# Altium project DoAn_NEW.PrjPcb
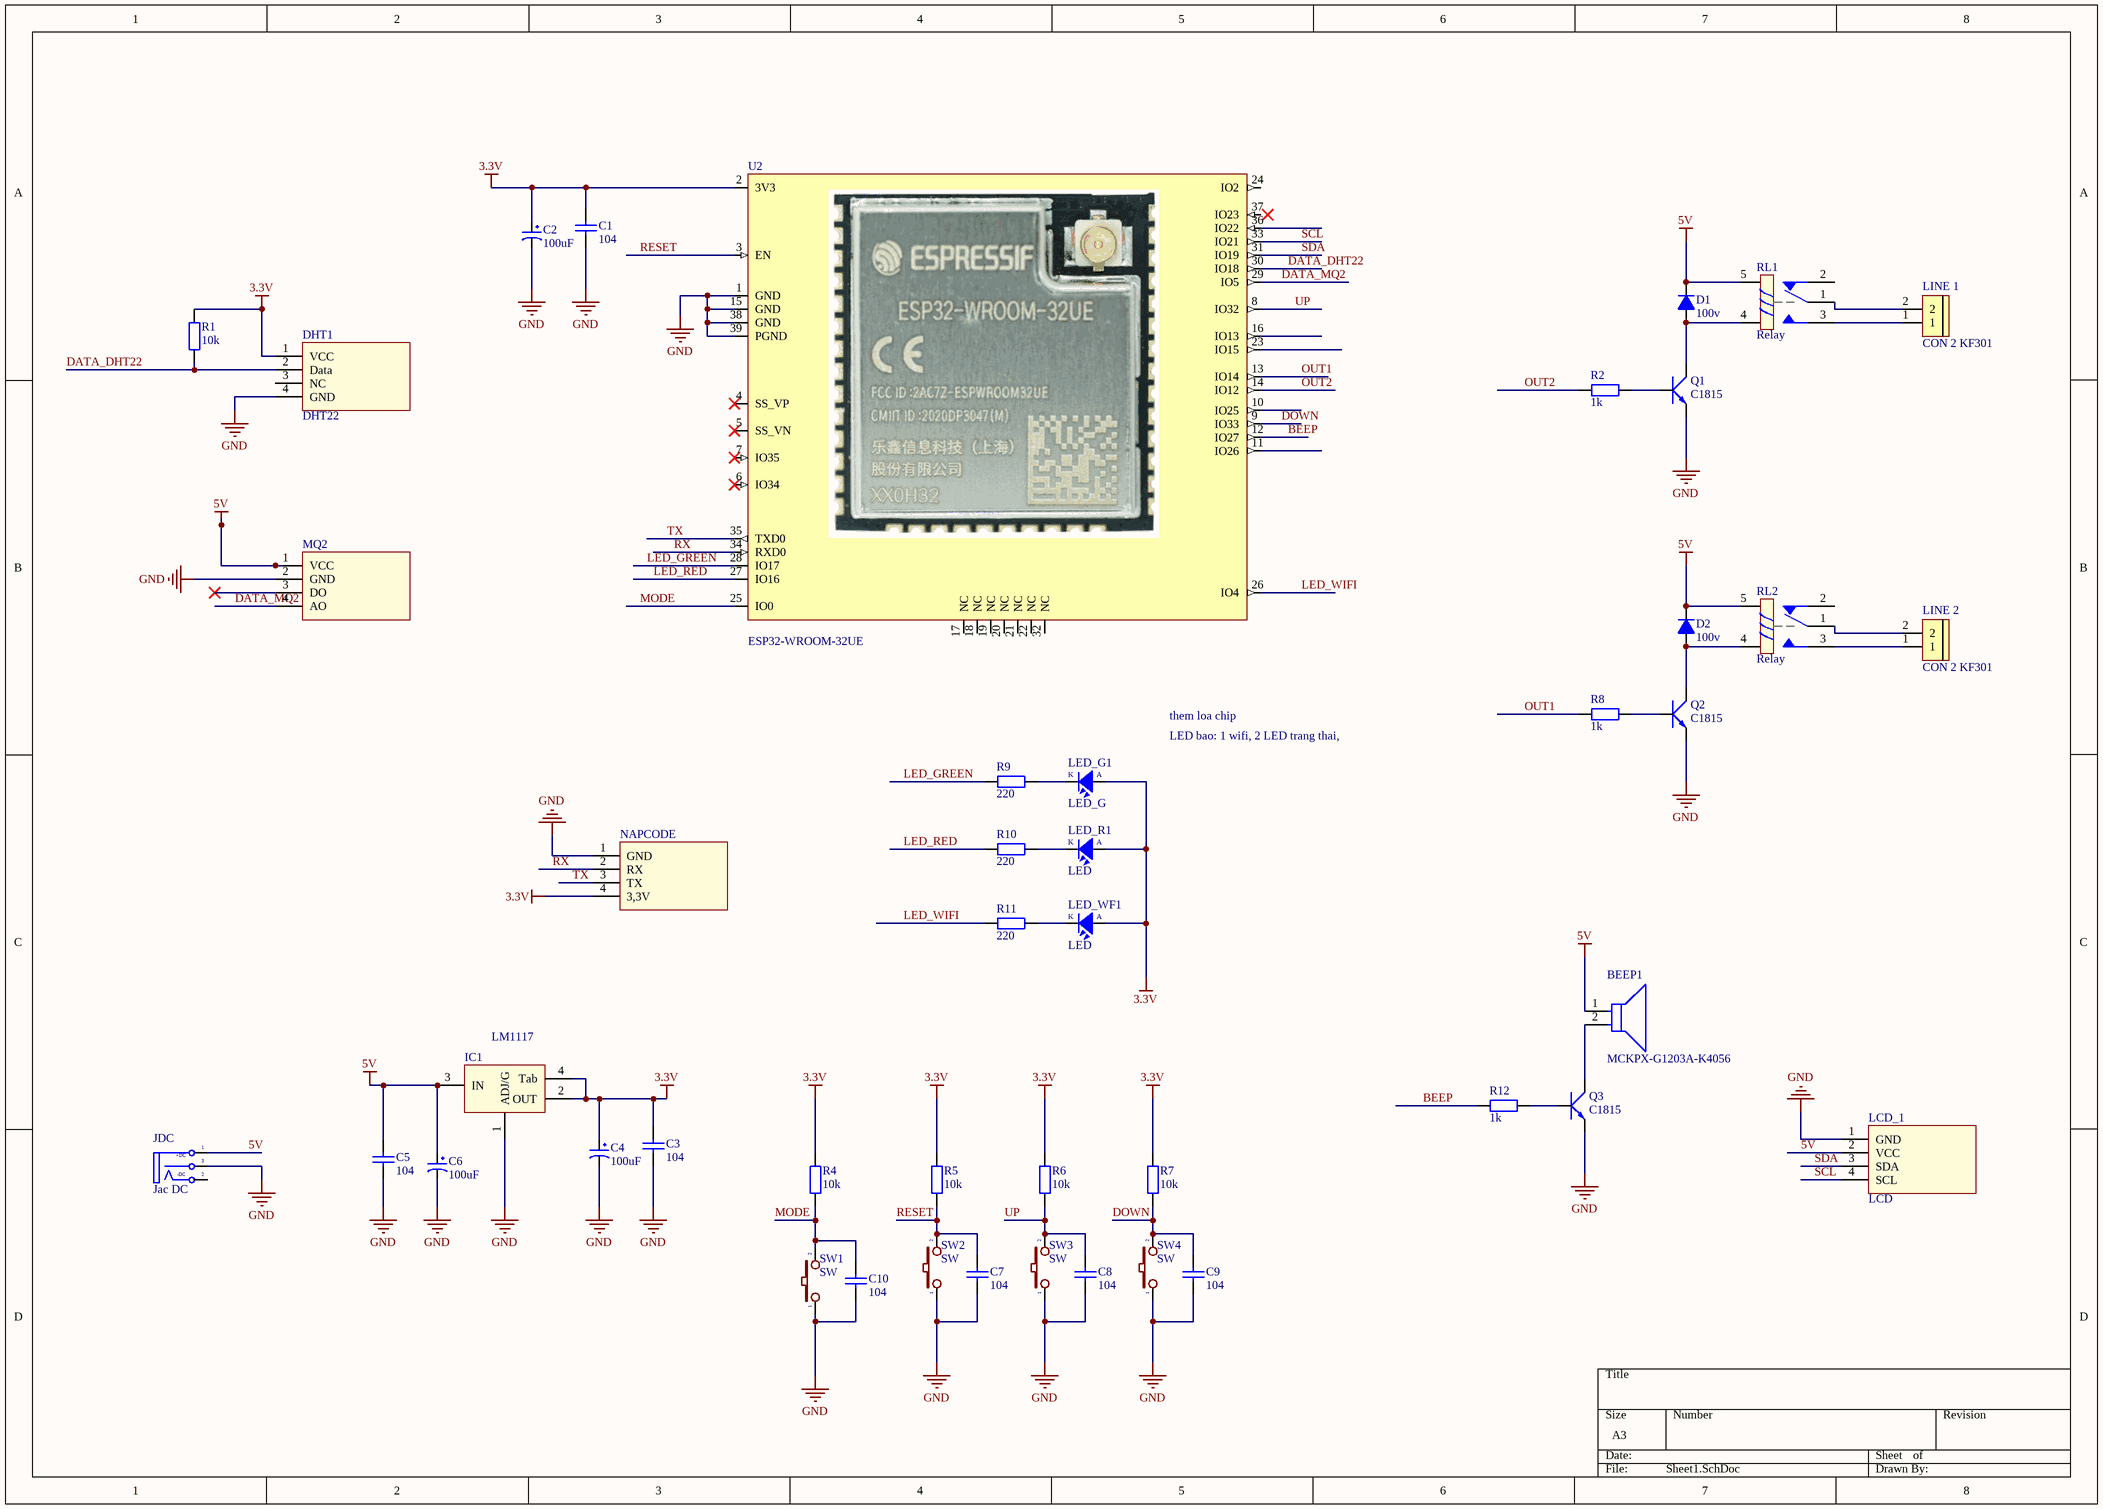
[diagram p0: Sheet1.SchDoc]
1 sheet, 45 parts. Net scope: global (net labels, ports and power ports of the same name join across sheets).
Board file: PCB1.PcbDoc

## Sheet Sheet1.SchDoc
size A3; SheetNumber: 1; SheetTotal: 1

### Parts
BEEP1  MCKPX-G1203A-K4056  [FP-MCKPX-G1203A-K4056-MFG]
C1  104  [tu gom]
C2  100uF  [tu hoa 5mm]
C3  104  [tu gom]
C4  100uF  [tu hoa 5mm]
C5  104  [tu gom]
C6  100uF  [tu hoa 5mm]
C7  104  [tu gom]
C8  104  [tu gom]
C9  104  [tu gom]
C10  104  [tu gom]
D1  100v  [DIODE 1A]
D2  100v  [DIODE 1A]
DHT1  DHT22  [jp4]
IC1  LM1117  [SOT223-4N]
JDC  Jac DC  [DC-IN]
LCD_1  LCD  [jp4]
LED_G1  LED_G  [LED-0805]
LED_R1  LED  [LED-0805]
LED_WF1  LED  [LED-0805]
LINE_1  CON 2 KF301  [Con 2 KF301 5.08]
LINE_2  CON 2 KF301  [Con 2 KF301 5.08]
MQ2  LCD  [jp4]  (value not drawn)
NAPCODE  LCD  [jp4]  (value not drawn)
Q1  C1815  [SOT23B]
Q2  C1815  [SOT23B]
Q3  C1815  [SOT23B]
R1  10k  [tro smd 0805]
R2  1k  [tro smd 0805]
R4  10k  [tro smd 0805]
R5  10k  [tro smd 0805]
R6  10k  [tro smd 0805]
R7  10k  [tro smd 0805]
R8  1k  [tro smd 0805]
R9  220  [tro smd 0805]
R10  220  [tro smd 0805]
R11  220  [tro smd 0805]
R12  1k  [tro smd 0805]
RL1  Relay  [RL_SPDT_10A]
RL2  Relay  [RL_SPDT_10A]
SW1  SW  [SW4_SMD]
SW2  SW  [SW4_SMD]
SW3  SW  [SW4_SMD]
SW4  SW  [SW4_SMD]
U2  ESP32-WROOM-32UE  [ESP32-WROOM-32UE]

### Nets
3.3V: C1.1 C2.1 C3.1 C4.1 DHT1.1(VCC) IC1.2(OUT) IC1.4(Tab) LED_G1.1(A) LED_R1.1(A) LED_WF1.1(A) NAPCODE.4(3,3V) R1.1 R4.1 R5.1 R6.1 R7.1 U2.2(3V3)
5V: BEEP1.1(C) C5.1 C6.1 D1.2(K) D2.2(K) IC1.3(IN) JDC.1(+DC) LCD_1.2(VCC) MQ2.1(VCC) RL1.5 RL2.5
GND: C1.2 C2.2 C3.2 C4.2 C5.2 C6.2 C7.2 C8.2 C9.2 C10.2 DHT1.4(GND) IC1.1(ADJ/G) JDC.3(S) LCD_1.1(GND) MQ2.2(GND) NAPCODE.1(GND) Q1.1(E) Q2.1(E) Q3.1(E) SW1.1 SW2.1 SW3.1 SW4.1 U2.1(GND) U2.15(GND) U2.38(GND) U2.39(PGND)
BEEP: R12.2 U2.12(IO27)
DATA_DHT22: DHT1.2(Data) R1.2 U2.30(IO18)
DATA_MQ2: MQ2.4(AO) U2.29(IO5)
DOWN: C9.1 R7.2 SW4.2 U2.9(IO33)
LED_GREEN: R9.1 U2.28(IO17)
LED_RED: R10.1 U2.27(IO16)
LED_WIFI: R11.1 U2.26(IO4)
MODE: C10.1 R4.2 SW1.2 U2.25(IO0)
OUT1: R8.2 U2.13(IO14)
OUT2: R2.2 U2.14(IO12)
RESET: C7.1 R5.2 SW2.2 U2.3(EN)
RX: NAPCODE.2(RX) U2.34(RXD0)
SCL: LCD_1.4(SCL) U2.33(IO21)
SDA: LCD_1.3(SDA) U2.31(IO19)
TX: NAPCODE.3(TX) U2.35(TXD0)
UP: C8.1 R6.2 SW3.2 U2.8(IO32)
NetBEEP1_2: BEEP1.2(A) Q3.2(C)
NetD1_1: D1.1(A) Q1.2(C) RL1.4
NetD2_1: D2.1(A) Q2.2(C) RL2.4
NetLED_G1_2: LED_G1.2(K) R9.2
NetLED_R1_2: LED_R1.2(K) R10.2
NetLED_WF1_2: LED_WF1.2(K) R11.2
NetLINE_1_1: LINE_1.1 RL1.3
NetLINE_1_2: LINE_1.2 RL1.1
NetLINE_2_1: LINE_2.1 RL2.3
NetLINE_2_2: LINE_2.2 RL2.1
NetQ1_3: Q1.3(B) R2.1
NetQ2_3: Q2.3(B) R8.1
NetQ3_3: Q3.3(B) R12.1

Not connected (* = marked no-connect by the designer): DHT1 3(NC); JDC 2(TN); MQ2 3(DO)*; RL1 2; RL2 2; U2 4(SS_VP)* 5(SS_VN)* 6(IO34)* 7(IO35)* 10(IO25) 11(IO26) 16(IO13) 17(NC) 18(NC) 19(NC) 20(NC) 21(NC) 22(NC) 23(IO15) 24(IO2) 32(NC) 36(IO22) 37(IO23)

### Notes on the sheet
- them loa chip
- LED bao: 1 wifi, 2 LED trang thai,
- (in symbol DCIN) -DC

### Library data of the parts
BEEP1 = CMP-12433-000001-1: MAGNETIC BUZZER AND TRANSDUCER - More Details; Manufacturer: Multicomp Pro; Operating Supply Voltage: 3V; Current: 30mA; Frequency: 2300Hz; Max Supply Voltage: 5V; Min Supply Voltage: 2V; Standoff Height: 0.5mm; ComponentLink2Description: Datasheet; ComponentLink2URL: http://www.farnell.com/datasheets/1498149.pdf?_ga=2.17855225.1157923166.1572356775-536200964.1569240579; Manufacturer Part Number: MCKPX-G1203A-K4056; Temperature Range High: +70°C; Device Class L2: Audio Products; Temperature Range Low: -20°C; Package: 0; Temperature: -20°C to +70°C; Category: Speak; Octopart: https://octopart.com/mckpx-g1203a-k4056-multicomp-12157154; RoHS: TRUE; Lead Free: Yes; Height: 9.5mm; Device Class L1: Electromechanical; Automotive: No; Device Class L3: Buzzers
C1 C3 C5 C7-C10 = Tu gom 104 50V: Cắm; So_Chan: 2; Ten_Linh_Kien: Tụ gốm 104 100nF 50V; Don_Vi: Con; Ma_Hang: MH004761; Chung_Loai: Cắm; Kieu_Chan: *
C2 C4 C6 = Tu Hoa 100uF 16V 5x11: Cắm; Don_Vi: Con; So_Chan: 2; Ten_Linh_Kien: Tụ Hóa 100uF 16V 5x11MM; Ma_Hang: MH008417; Chung_Loai: Cắm; Kieu_Chan: *
D1 D2 = Diode 1N4007: Cắm; Ten_Linh_Kien: Diode 1N4007 1A (DIP); Don_Vi: Con; Ma_Hang: MH001063; Ghi Chu: *; Kieu_Chan: *; Chung_Loai: Cắm
DHT1 LCD_1 MQ2 NAPCODE = DHT1x: Humidity and Temperature Sensor
IC1 = LM1117: 3v3; Value: LM317
JDC = DCIN: Jac DC input; Value: Jac DC
LED_G1 LED_R1 LED_WF1 = LED: LED Single colour Green and Red; Value: LED 3 ly Single Colour
LINE_1 LINE_2 = CON 2 KF301: Cắm; Ma_Hang: MH000987; Ten_Linh_Kien: CON 2 KF301-2P 5.08MM Xanh Dương; Chung_Loai: Cắm; Ghi_Chu: *; Kieu_Chan: *; Don_Vi: Con
Q1-Q3 = C1815: NPN 600mW, ECB; Value: C1815
R1 R2 R4-R8 R12 = Tro 0805 5% 0R: Dán; Don_Vi: Con; So_Chan: 2; Ten_Linh_Kien: Trở 0805 5% 0R; Ma_Hang: MH005230; Chung_Loai: Dán; Kieu_Chan: *
R9-R11 = Tro 0805 1% 1R: Dán; Don_Vi: Con; So_Chan: 2; Ten_Linh_Kien: Trở 0805 1% 1R; Ma_Hang: MH004177; Chung_Loai: Dán; Kieu_Chan: *
RL1 RL2 = Relay 1: Relay SPDT 5 Pin; Value: Relay SPDT, 10A, 12V
SW1-SW4 = SW2: Switch button 2 pin; Value: SW chip 2 pin
U2 = ESP32-WROOM-32UE: Rx Txrx Module Wifi U.fl SMD; Manufacturer 1: Espressif Systems; Manufacturer Part Number 1: ESP32-WROOM-32UE(M113EH3200UH3Q0); Supplier 1: Digi-Key; Supplier Part Number 1: 1965-ESP32-WROOM-32UE-N4TR-ND; RoHS: No; Description 1: Rx Txrx Module Wifi U.fl SMD; Category: RF Receivers, Transceivers; Stock: 10282; Pricing 1: 650=3,00000 (USD)